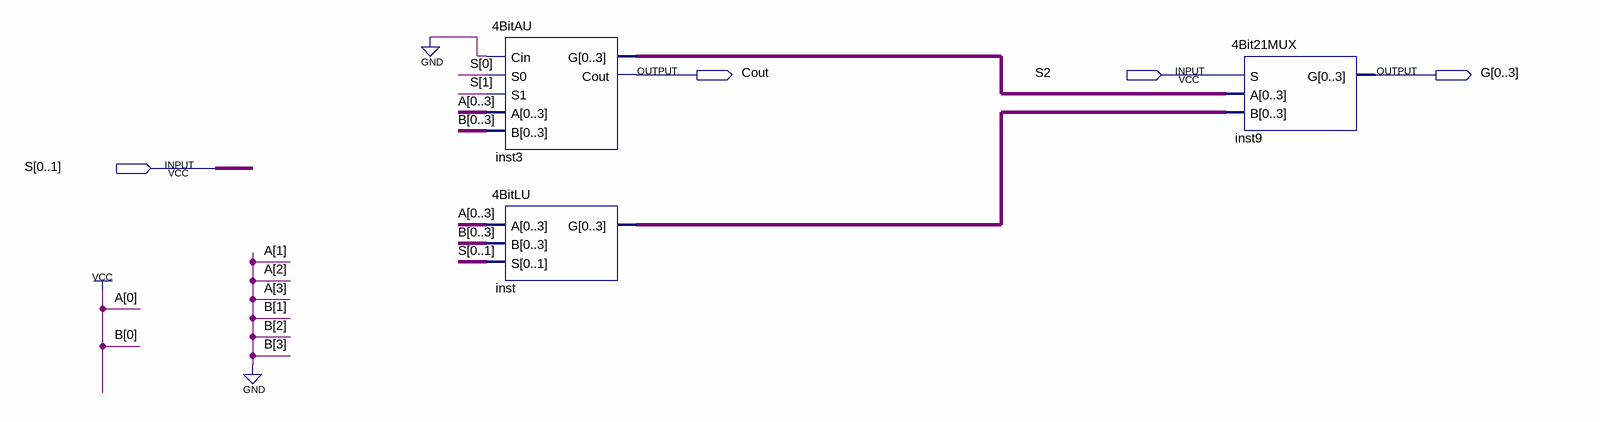
[diagram p0: schematic sheet]
// Quartus schematic FDDLab3.bdf as structural Verilog: 3 symbols, 4 pins
module FDDLab3 (
  input  S2,
  input  [0:1] S,
  output Cout,
  output [0:3] G
);

  wire [3:0] inst3_g, inst_g;

  \4BitAU  inst3 (.Cin(1'b0), .S0(S[0]), .S1(S[1]), .A(4'b1000), .B(4'b1000), .G(inst3_g), .Cout(Cout));
  \4BitLU  inst (.A(4'b1000), .B(4'b1000), .S(S), .G(inst_g));
  \4Bit21MUX  inst9 (.S(S2), .A(inst3_g), .B(inst_g), .G(G));
endmodule
